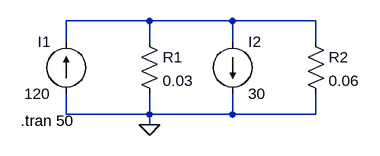
[diagram p0: schematic 3.asc]
3.asc, the LTspice schematic file:
Version 4
SHEET 1 880 680
WIRE 144 96 16 96
WIRE 272 96 144 96
WIRE 400 96 272 96
WIRE 16 128 16 96
WIRE 144 128 144 96
WIRE 272 128 272 96
WIRE 400 128 400 96
WIRE 16 240 16 208
WIRE 144 240 144 208
WIRE 144 240 16 240
WIRE 272 240 272 208
WIRE 272 240 144 240
WIRE 400 240 400 208
WIRE 400 240 272 240
WIRE 144 256 144 240
FLAG 144 256 0
SYMBOL current 16 208 R180
WINDOW 0 24 80 Left 2
WINDOW 3 24 0 Left 2
WINDOW 123 0 0 Left 2
WINDOW 39 0 0 Left 2
SYMATTR InstName I1
SYMATTR Value 120
SYMBOL res 128 112 R0
SYMATTR InstName R1
SYMATTR Value 0.03
SYMBOL current 272 128 R0
WINDOW 123 0 0 Left 2
WINDOW 39 0 0 Left 2
SYMATTR InstName I2
SYMATTR Value 30
SYMBOL res 384 112 R0
SYMATTR InstName R2
SYMATTR Value 0.06
TEXT -54 250 Left 2 !.tran 50

The netlist it stands for:
* 3.asc
I1 0 N001 120
R1 N001 0 0.03
I2 N001 0 30
R2 N001 0 0.06
.tran 50
.backanno
.end